# Altium schematic sheet POWER.SchDoc
size A4
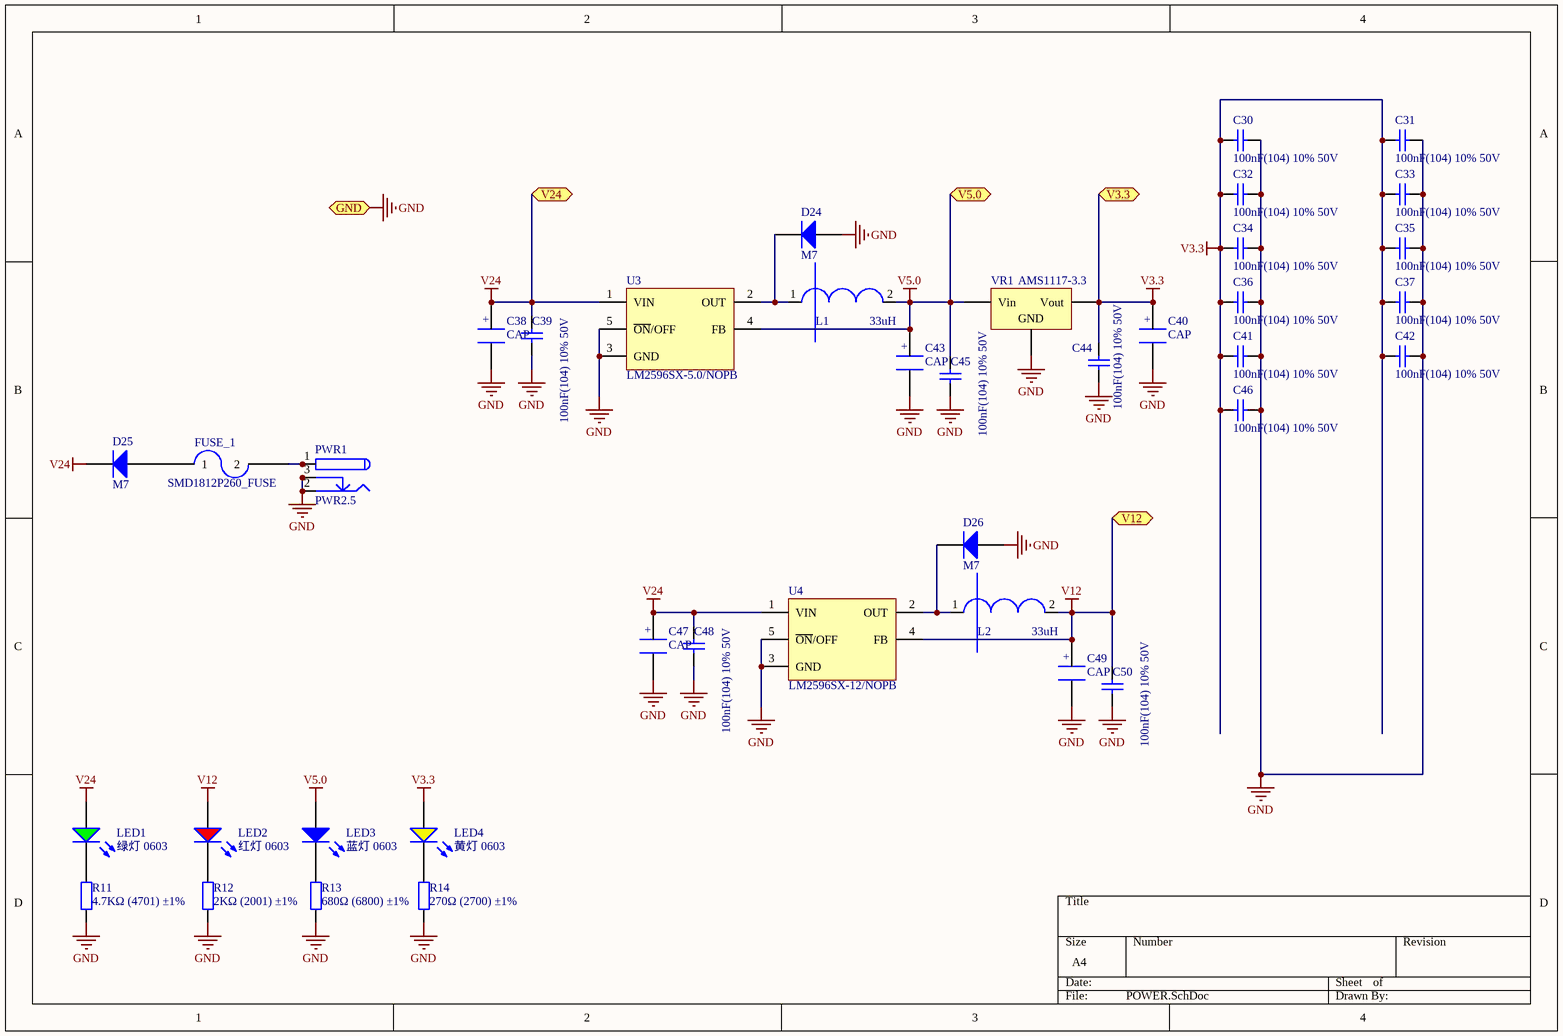
[diagram p0: POWER.SchDoc]

## Parts
C30  100nF(104) 10% 50V  [0805_C]
C31  100nF(104) 10% 50V  [0805_C]
C32  100nF(104) 10% 50V  [0805_C]
C33  100nF(104) 10% 50V  [0805_C]
C34  100nF(104) 10% 50V  [0805_C]
C35  100nF(104) 10% 50V  [0805_C]
C36  100nF(104) 10% 50V  [0805_C]
C37  100nF(104) 10% 50V  [0805_C]
C38  CAP  [8X12_CAP]
C39  100nF(104) 10% 50V  [0805_C]
C40  CAP  [8X12_CAP]
C41  100nF(104) 10% 50V  [0805_C]
C42  100nF(104) 10% 50V  [0805_C]
C43  CAP  [8X12_CAP]
C44  100nF(104) 10% 50V  [0805_C]
C45  100nF(104) 10% 50V  [0805_C]
C46  100nF(104) 10% 50V  [0805_C]
C47  CAP  [8X12_CAP]
C48  100nF(104) 10% 50V  [0805_C]
C49  CAP  [8X12_CAP]
C50  100nF(104) 10% 50V  [0805_C]
D24  M7  [SMA(DO-214AC)_S1]
D25  M7  [SMA(DO-214AC)_S1]
D26  M7  [SMA(DO-214AC)_S1]
FUSE_1  SMD1812P260_FUSE  [SMD1812P260]
L1  33uH  [L_127]
L2  33uH  [L_127]
LED1  绿灯 0603  [0603_LED_S1]
LED2  红灯 0603  [0603_LED_S1]
LED3  蓝灯 0603  [0603_LED_S1]
LED4  黄灯 0603  [0603_LED_S1]
PWR1  PWR2.5  [KLD-0202]
R11  4.7KΩ (4701) ±1%  [0805_R]
R12  2KΩ (2001) ±1%  [0805_R]
R13  680Ω (6800) ±1%  [0805_R]
R14  270Ω (2700) ±1%  [0805_R]
U3  LM2596SX-5.0/NOPB  [TO-263-5]
U4  LM2596SX-12/NOPB  [TO-263-5]
VR1  AMS1117-3.3  [SOT-223]

## Ports
GND, V3.3, V5.0, V12, V24

## Nets
GND: C30.1 C31.1 C32.1 C33.1 C34.1 C35.1 C36.1 C37.1 C38.2 C39.2 C40.2 C41.1 C42.1 C43.2 C44.2 C45.2 C46.1 C47.2 C48.2 C49.2 C50.2 D24.1(A) D26.1(A) PWR1.2 PWR1.2A PWR1.2B PWR1.3 PWR1.3A PWR1.3B R11.1 R12.1 R13.1 R14.1 U3.3(GND) U3.5(~{ON}/OFF) U4.3(GND) U4.5(~{ON}/OFF) VR1.1(GND) ; port GND
V3.3: C30.2 C31.2 C32.2 C33.2 C34.2 C35.2 C36.2 C37.2 C40.1 C41.2 C42.2 C44.1 C46.2 LED4.A VR1.2(Vout) ; port V3.3
V5.0: C43.1 C45.1 L1.2 LED3.A U3.4(FB) VR1.3(Vin) ; port V5.0
V12: C49.1 C50.1 L2.2 LED2.A U4.4(FB) ; port V12
V24: C38.1 C39.1 C47.1 C48.1 D25.2(K) LED1.A U3.1(VIN) U4.1(VIN) ; port V24
NetD24_2: D24.2(K) L1.1 U3.2(OUT)
NetD25_1: D25.1(A) FUSE_1.1
NetD26_2: D26.2(K) L2.1 U4.2(OUT)
NetFUSE_1_2: FUSE_1.2 PWR1.1 PWR1.1A PWR1.1B
NetLED1_K: LED1.K R11.2
NetLED2_K: LED2.K R12.2
NetLED3_K: LED3.K R13.2
NetLED4_K: LED4.K R14.2

## Notes on the sheet
- (in symbol CAP) +

## Library data of the parts
C30-C37 C39 C41 C42 C44-C46 C48 C50 = 0805 100nF(104) 10% 50V: 贴片电容; ComponentLink1Description: 供应商链接; ComponentLink1URL: http://www.szlcsc.com/product/details_50686.html; Package: 0805; Supplier: LC; SuppliersPartNumber: C49678
D24-D26 = SMA(DO-214AC) M7: 二极管; 备注: 1N4007 4007 编号C2464 已经停售, 使用新物料编号C95872; ComponentLink1Description: 供应商链接; ComponentLink1URL: http://www.szlcsc.com/product/details_2841.html; Package: SMA(DO-214AC); Supplier: LC; SuppliersPartNumber: C95872
LED1 = 0603 绿灯: 发光二极管; ComponentLink1Description: 供应商链接; ComponentLink1URL: http://www.szlcsc.com/product/details_73152.html; Package: 0603; Supplier: LC; SuppliersPartNumber: C72043
LED2 = 0603 红灯: 发光二极管; ComponentLink1Description: 供应商链接; ComponentLink1URL: http://www.szlcsc.com/product/details_2659.html; Package: 0603; Supplier: LC; SuppliersPartNumber: C2286
LED3 = 0603 蓝灯: 发光二极管; ComponentLink1Description: 供应商链接; ComponentLink1URL: http://www.szlcsc.com/product/details_73150.html; Package: 0603; Supplier: LC; SuppliersPartNumber: C72041
LED4 = 0603 黄灯: 发光二极管; ComponentLink1Description: 供应商链接; ComponentLink1URL: http://www.szlcsc.com/product/details_73147.html; Package: 0603; Supplier: LC; SuppliersPartNumber: C72038
PWR1 = PWR2.5: Low Voltage Power Supply Connector; Published: 17-Dec-2003; DatasheetDocument: 09-May-2002; Publisher: Altium Limited; ComponentLink1Description: Manufacturer Link; ComponentLink1URL: http://domino.kycon.com/internet/Products.html
R11 = 0805 4.7KΩ (4701) 1%: 贴片电阻; ComponentLink1Description: 供应商链接; ComponentLink1URL: http://www.szlcsc.com/product/details_18361.html; Package: 0805; Supplier: LC; SuppliersPartNumber: C17673
R12 = 0805 2KΩ (2001) 1%: 贴片电阻; ComponentLink1Description: 供应商链接; ComponentLink1URL: http://www.szlcsc.com/product/details_18292.html; Package: 0805; Supplier: LC; SuppliersPartNumber: C17604
R13 = 0805 680Ω (6800) 1%: 贴片电阻; ComponentLink1Description: 供应商链接; ComponentLink1URL: http://www.szlcsc.com/product/details_18486.html; Package: 0805; Supplier: LC; SuppliersPartNumber: C17798
R14 = 0805 270Ω (2700) 1%: 贴片电阻; ComponentLink1Description: 供应商链接; ComponentLink1URL: http://www.szlcsc.com/product/details_18278.html; Package: 0805; Supplier: LC; SuppliersPartNumber: C17590
U3 U4 = LM2596SX-5.0/NOPB_[C10002]: DC-DC芯片; ComponentLink1Description: 供应商链接; ComponentLink1URL: http://www.szlcsc.com/product/details_10538.html; Package: TO-263-5; Supplier: LC; SuppliersPartNumber: C10002
VR1 = SOT-223 AMS1117-3.3: 低压差线性稳压(LDO); ComponentLink1Description: 供应商链接; ComponentLink1URL: http://www.szlcsc.com/product/details_6652.html; Package: SOT-223; Supplier: LC; SuppliersPartNumber: C6186